# Altium schematic sheet pt100.SchDoc
size A4
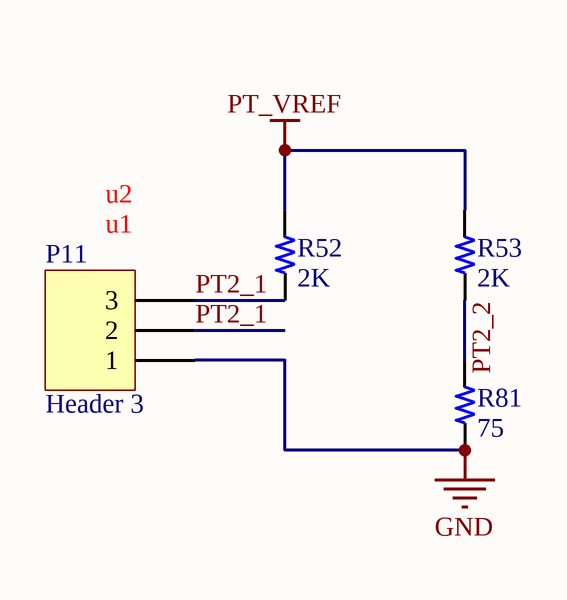
[diagram p0: pt100.SchDoc]

## Parts
P11  Header 3  [KF7.62-3P]
R52  2K  [0603R]
R53  2K  [0603R]
R81  75  [0603R]

## Nets
GND: P11.1 R81.1
PT_VREF: R52.2 R53.2
PT2_1: P11.2 P11.3 R52.1
PT2_2: R53.1 R81.2

## Notes on the sheet
- (near P11) u1
- (near P11) u2

## Library data of the parts
P11 = Header 3: Header, 3-Pin; LatestRevisionDate: 17-Jul-2002; LatestRevisionNote: Re-released for DXP Platform.; Publisher: Altium Limited
R52 R53 = R: Value: 2K/1%
R81 = R: Value: 75